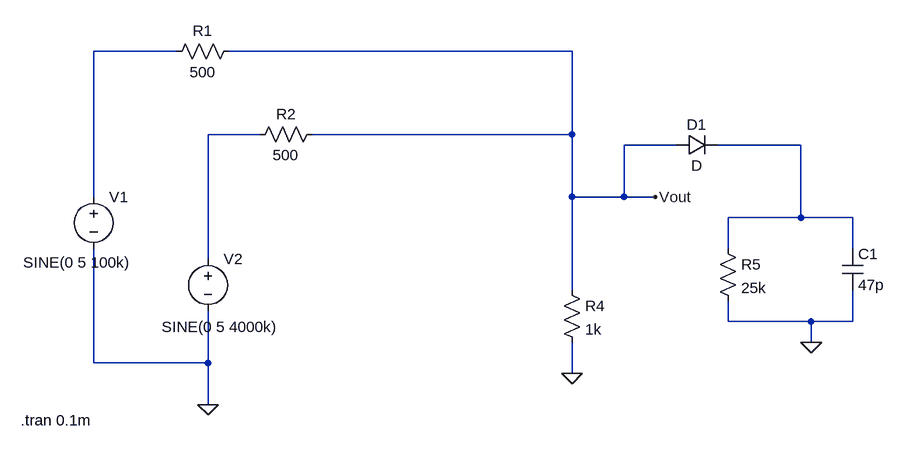
[diagram p0: schematic ED.asc]
ED.asc, the LTspice schematic file:
Version 4
SHEET 1 1360 680
WIRE 256 -128 128 -128
WIRE 864 -128 336 -128
WIRE 384 0 304 0
WIRE 864 0 864 -128
WIRE 864 0 464 0
WIRE 1024 16 944 16
WIRE 1216 16 1088 16
WIRE 128 96 128 -128
WIRE 864 96 864 0
WIRE 944 96 944 16
WIRE 944 96 864 96
WIRE 992 96 944 96
WIRE 1216 128 1216 16
WIRE 1216 128 1104 128
WIRE 1296 128 1216 128
WIRE 1104 176 1104 128
WIRE 1296 176 1296 128
WIRE 304 192 304 0
WIRE 864 240 864 96
WIRE 1104 288 1104 256
WIRE 1232 288 1104 288
WIRE 1296 288 1296 240
WIRE 1296 288 1232 288
WIRE 1232 320 1232 288
WIRE 128 352 128 176
WIRE 304 352 304 272
WIRE 304 352 128 352
WIRE 864 368 864 320
WIRE 304 416 304 352
FLAG 304 416 0
FLAG 864 368 0
FLAG 992 96 Vout
FLAG 1232 320 0
SYMBOL voltage 128 80 R0
WINDOW 3 -108 117 Left 2
WINDOW 123 0 0 Left 0
WINDOW 39 0 0 Left 0
SYMATTR Value SINE(0 5 100k)
SYMATTR InstName V1
SYMBOL voltage 304 176 R0
WINDOW 3 -71 120 Left 2
WINDOW 123 0 0 Left 0
WINDOW 39 0 0 Left 0
SYMATTR Value SINE(0 5 4000k)
SYMATTR InstName V2
SYMBOL res 352 -144 R90
WINDOW 0 0 56 VBottom 2
WINDOW 3 32 56 VTop 2
SYMATTR InstName R1
SYMATTR Value 500
SYMBOL res 480 -16 R90
WINDOW 0 0 56 VBottom 2
WINDOW 3 32 56 VTop 2
SYMATTR InstName R2
SYMATTR Value 500
SYMBOL res 848 224 R0
SYMATTR InstName R4
SYMATTR Value 1k
SYMBOL cap 1280 176 R0
SYMATTR InstName C1
SYMATTR Value 47p
SYMBOL diode 1024 32 R270
WINDOW 0 32 32 VTop 2
WINDOW 3 0 32 VBottom 2
SYMATTR InstName D1
SYMBOL res 1088 160 R0
SYMATTR InstName R5
SYMATTR Value 25k
TEXT 16 440 Left 2 !.tran 0.1m

The netlist it stands for:
* ED.asc
V1 N001 0 SINE(0 5 100k)
V2 N002 0 SINE(0 5 4000k)
R1 Vout N001 500
R2 Vout N002 500
R4 Vout 0 1k
C1 N003 0 47p
D1 Vout N003 D
R5 N003 0 25k
.model D D
.lib standard.dio
.tran 0.1m
.backanno
.end